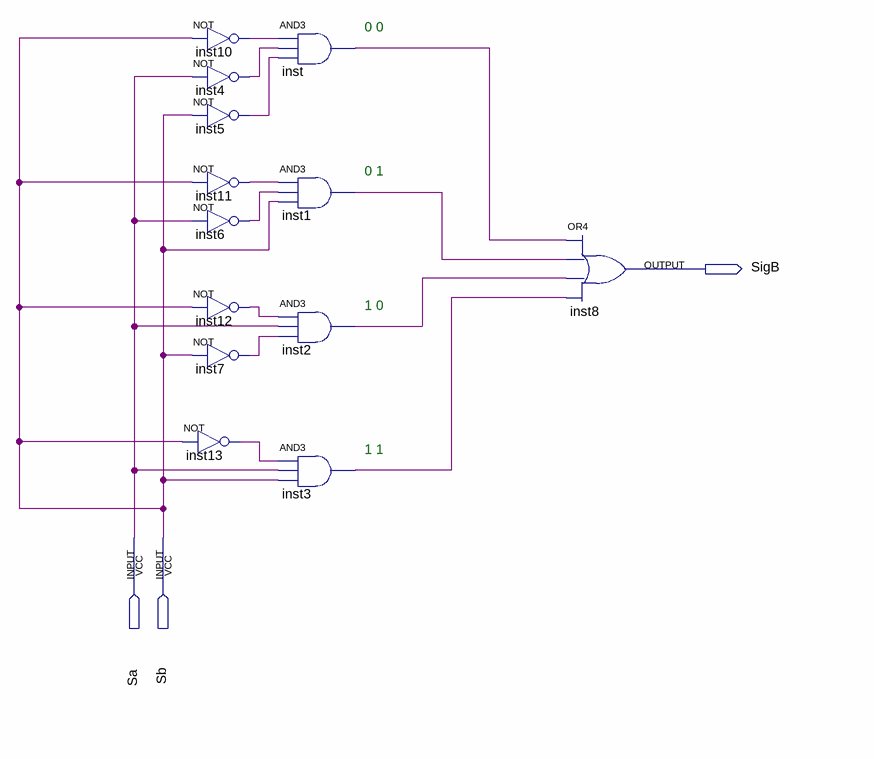
[diagram p0: schematic sheet]
// Quartus schematic TrataSinalSubtracao.bdf as structural Verilog: 13 symbols, 3 pins
module TrataSinalSubtracao (
  input  Sa,
  input  Sb,
  output SigB
);

  wire inst1_out, inst2_out, inst3_out, inst4_out, inst5_out, inst6_out, inst7_out, inst10_out, inst11_out,
       inst12_out, inst13_out, inst_out;

  not inst10 (inst10_out, Sb);
  not inst4 (inst4_out, Sa);
  not inst5 (inst5_out, Sb);
  not inst11 (inst11_out, Sb);
  not inst6 (inst6_out, Sa);
  not inst12 (inst12_out, Sb);
  not inst7 (inst7_out, Sb);
  not inst13 (inst13_out, Sb);
  and inst (inst_out, inst10_out, inst4_out, inst5_out);
  and inst1 (inst1_out, inst11_out, inst6_out, Sb);
  and inst2 (inst2_out, inst12_out, Sa, inst7_out);
  and inst3 (inst3_out, inst13_out, Sa, Sb);
  or inst8 (SigB, inst_out, inst1_out, inst2_out, inst3_out);

  // Notes on the sheet:
  //   0 0
  //   0 1
  //   1 0
  //   1 1
endmodule
